# Altium schematic sheet ESP-12S.SchDoc
size A4
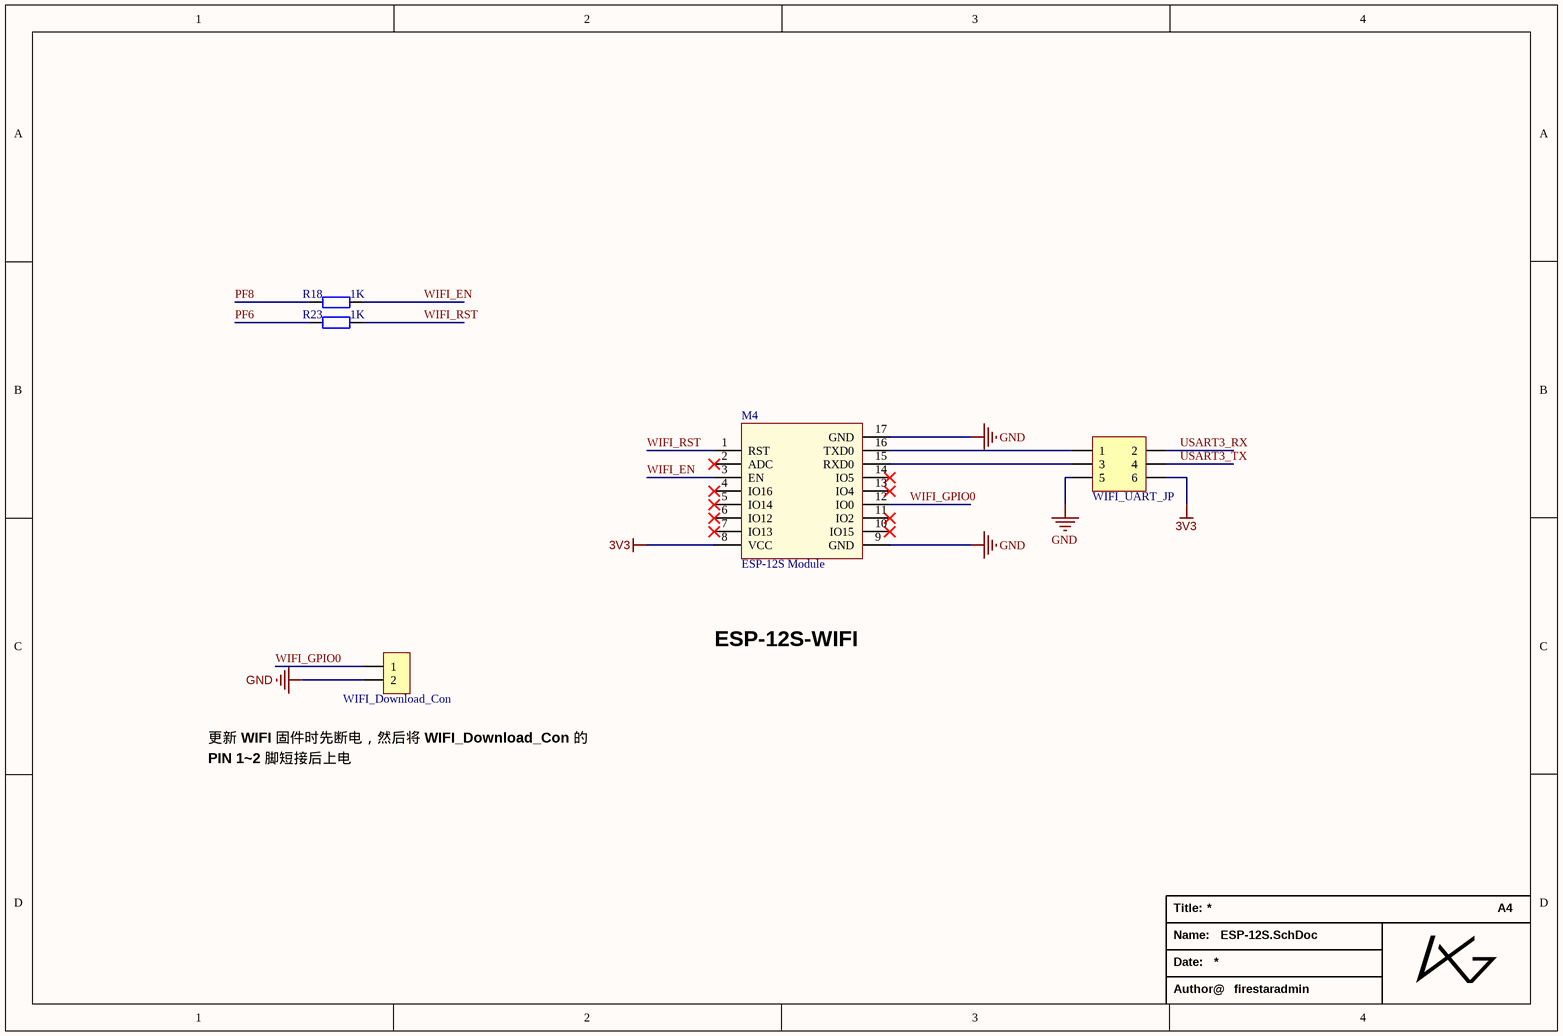
[diagram p0: ESP-12S.SchDoc]

## Parts
M4  ESP-12S Module  [ESP-12S Module]
R18  1K  [R 0603_M]
R23  1K  [R 0603_M]
WIFI_Download_Con  HDR-1X2  [HDR2.54-LI-2P]  (value not drawn)
WIFI_UART_JP  Header3X2  [HDR2.54-LI-2x3P]  (value not drawn)

## Nets
3V3: M4.8(VCC) WIFI_UART_JP.6
GND: M4.9(GND) M4.17(GND) WIFI_Download_Con.2 WIFI_UART_JP.5
PF6: R23.2
PF8: R18.2
USART3_RX: WIFI_UART_JP.2
USART3_TX: WIFI_UART_JP.4
WIFI_EN: M4.3(EN) R18.1
WIFI_GPIO0: M4.12(IO0) WIFI_Download_Con.1
WIFI_RST: M4.1(RST) R23.1
NetM4_15: M4.15(RXD0) WIFI_UART_JP.3
NetM4_16: M4.16(TXD0) WIFI_UART_JP.1

Not connected (* = marked no-connect by the designer): M4 2(ADC)* 4(IO16)* 5(IO14)* 6(IO12)* 7(IO13)* 10(IO15)* 11(IO2)* 13(IO4)* 14(IO5)*

## Notes on the sheet
- ESP-12S-WIFI
- (near WIFI_Download_Con) 更新 WIFI 固件时先断电，然后将 WIFI_Download_Con 的
- PIN 1~2 脚短接后上电
- Title:
- A4
- Name:
- Date:
- Author@
- firestaradmin

## Library data of the parts
R18 R23 = RES: Resistor
WIFI_Download_Con = Header 2: 2P接插件; 版权归属: 源创客; BOM名称: 2P接插件; 学习资源: www.ooocke.com
WIFI_UART_JP = Header 3X2: 3*2P接插件; 版权归属: 源创客; BOM名称: 3*2P接插件; 学习资源: www.ooocke.com